# EAGLE schematic PuckerUpVibe (EAGLE 9.5.2)
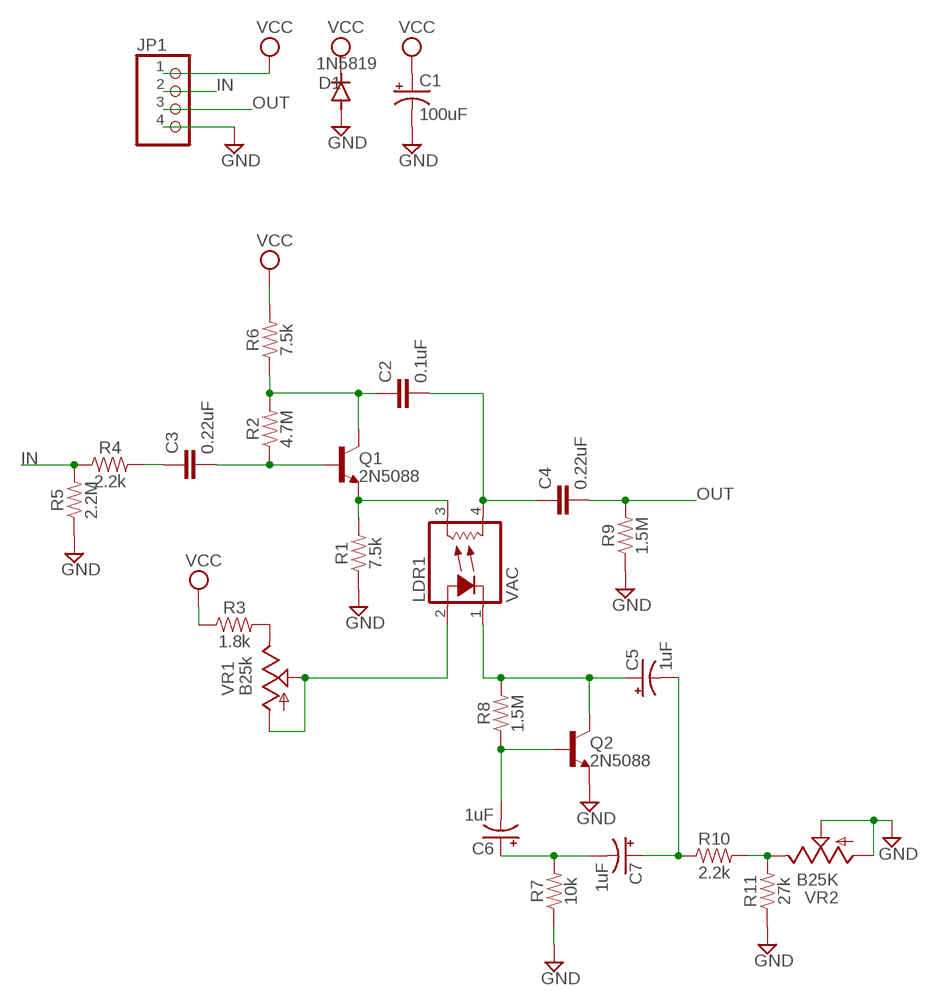
[diagram p0: schematic, sheet 1]

## Parts
C1  100uF  CAP_SMD+THRUPAN_B  [PAN_B_SMD+THRU]
C2  0.1uF  0.1UF-0603-25V-(+80/-20%)  [0603]
C3  0.22uF  0.22UF-0603-25V-10%  [0603]
C4  0.22uF  0.22UF-0603-25V-10%  [0603]
C5  1uF  CAP_SMD+THRUPAN_B  [PAN_B_SMD+THRU]
C6  1uF  CAP_SMD+THRUPAN_B  [PAN_B_SMD+THRU]
C7  1uF  CAP_SMD+THRUPAN_B  [PAN_B_SMD+THRU]
D1  1N5819  DIODE-SOD123  [SOD123]
JP1  PINHD-1X4  [1X04]
LDR1  VAC  VACTROL_4PIN  [VACTROL_4PIN_VTL5C]
Q1  2N5088  [TO92-]
Q2  2N5088  [TO92-]
R1  7.5k  RESISTOR0603  [0603]
R2  4.7M  RESISTOR0603  [0603]
R3  1.8k  RESISTOR0603  [0603]
R4  2.2k  RESISTOR0603  [0603]
R5  2.2M  RESISTOR0603  [0603]
R6  7.5k  RESISTOR0603  [0603]
R7  10k  RESISTOR0603  [0603]
R8  1.5M  RESISTOR0603  [0603]
R9  1.5M  RESISTOR0603  [0603]
R10  2.2k  RESISTOR0603  [0603]
R11  27k  RESISTOR0603  [0603]
VR1  B25k  9MM_SNAP-IN_POT_  [9MM_SNAP-IN_POT]
VR2  B25K  9MM_SNAP-IN_POT_  [9MM_SNAP-IN_POT]

## Nets
GND: C1.- C1.--(-) D1.A JP1.4 Q2.3(E) R1.1 R5.1 R7.1 R9.1 R11.1 VR2.1(A) VR2.2(S)
IN: JP1.2 R4.1 R5.2
N$1: R10.2 R11.2 VR2.3(E)
N$3: C3.1 R4.2
N$4: C3.2 Q1.2(B) R2.1
N$5: C2.1 Q1.1(C) R2.2 R6.1
N$6: LDR1.3(RES1) Q1.3(E) R1.2
N$7: C2.2 C4.1 LDR1.4(RES2)
N$8: R3.2 VR1.3(E)
N$9: LDR1.2(LED+) VR1.1(A) VR1.2(S)
N$10: C5.+ C5.++(+) LDR1.1(LED-) Q2.1(C) R8.2
N$11: C6.- C6.--(-) Q2.2(B) R8.1
N$12: C6.+ C6.++(+) C7.- C7.--(-) R7.2
N$13: C5.- C5.--(-) C7.+ C7.++(+) R10.1
OUT: C4.2 JP1.3 R9.2
VCC: C1.+ C1.++(+) D1.C JP1.1 R3.1 R6.2

## Library data of the parts
C1 C5-C7 = MusicThingModular:CAP_SMD+THRU
C2 = SparkFun-Capacitors:0.1UF: 0.1µF ceramic capacitors A capacitor is a passive two-terminal electrical component used to store electrical energy temporarily in an electric field.; PROD_ID: CAP-00810
C3 C4 = SparkFun-Capacitors:0.22UF: 0.22µF ceramic capacitors A capacitor is a passive two-terminal electrical component used to store electrical energy temporarily in an electric field.; PROD_ID: CAP-07822
D1 = diode:DIODE-: DIODE
JP1 = Connector:PINHD-1X4: PIN HEADER; CATEGORY: CONNECTOR; SUB-CATEGORY: PIN-HEADER
LDR1 = MusicThingModular:VACTROL_4PIN: 4 Pin Vactrol Resistive Photocoupler
Q1 Q2 = gm-trans:2N5088: NPN Transistor
R1-R11 = SparkFun-Resistors:RESISTOR: Generic Resistor Package
VR1 VR2 = MusicThingModular:9MM_SNAP-IN_POT: 9mm vertical snap-in pot, Alpha / Panasonic style